# EAGLE design 70MHz_DDS_generator (EAGLE 7.3.0)
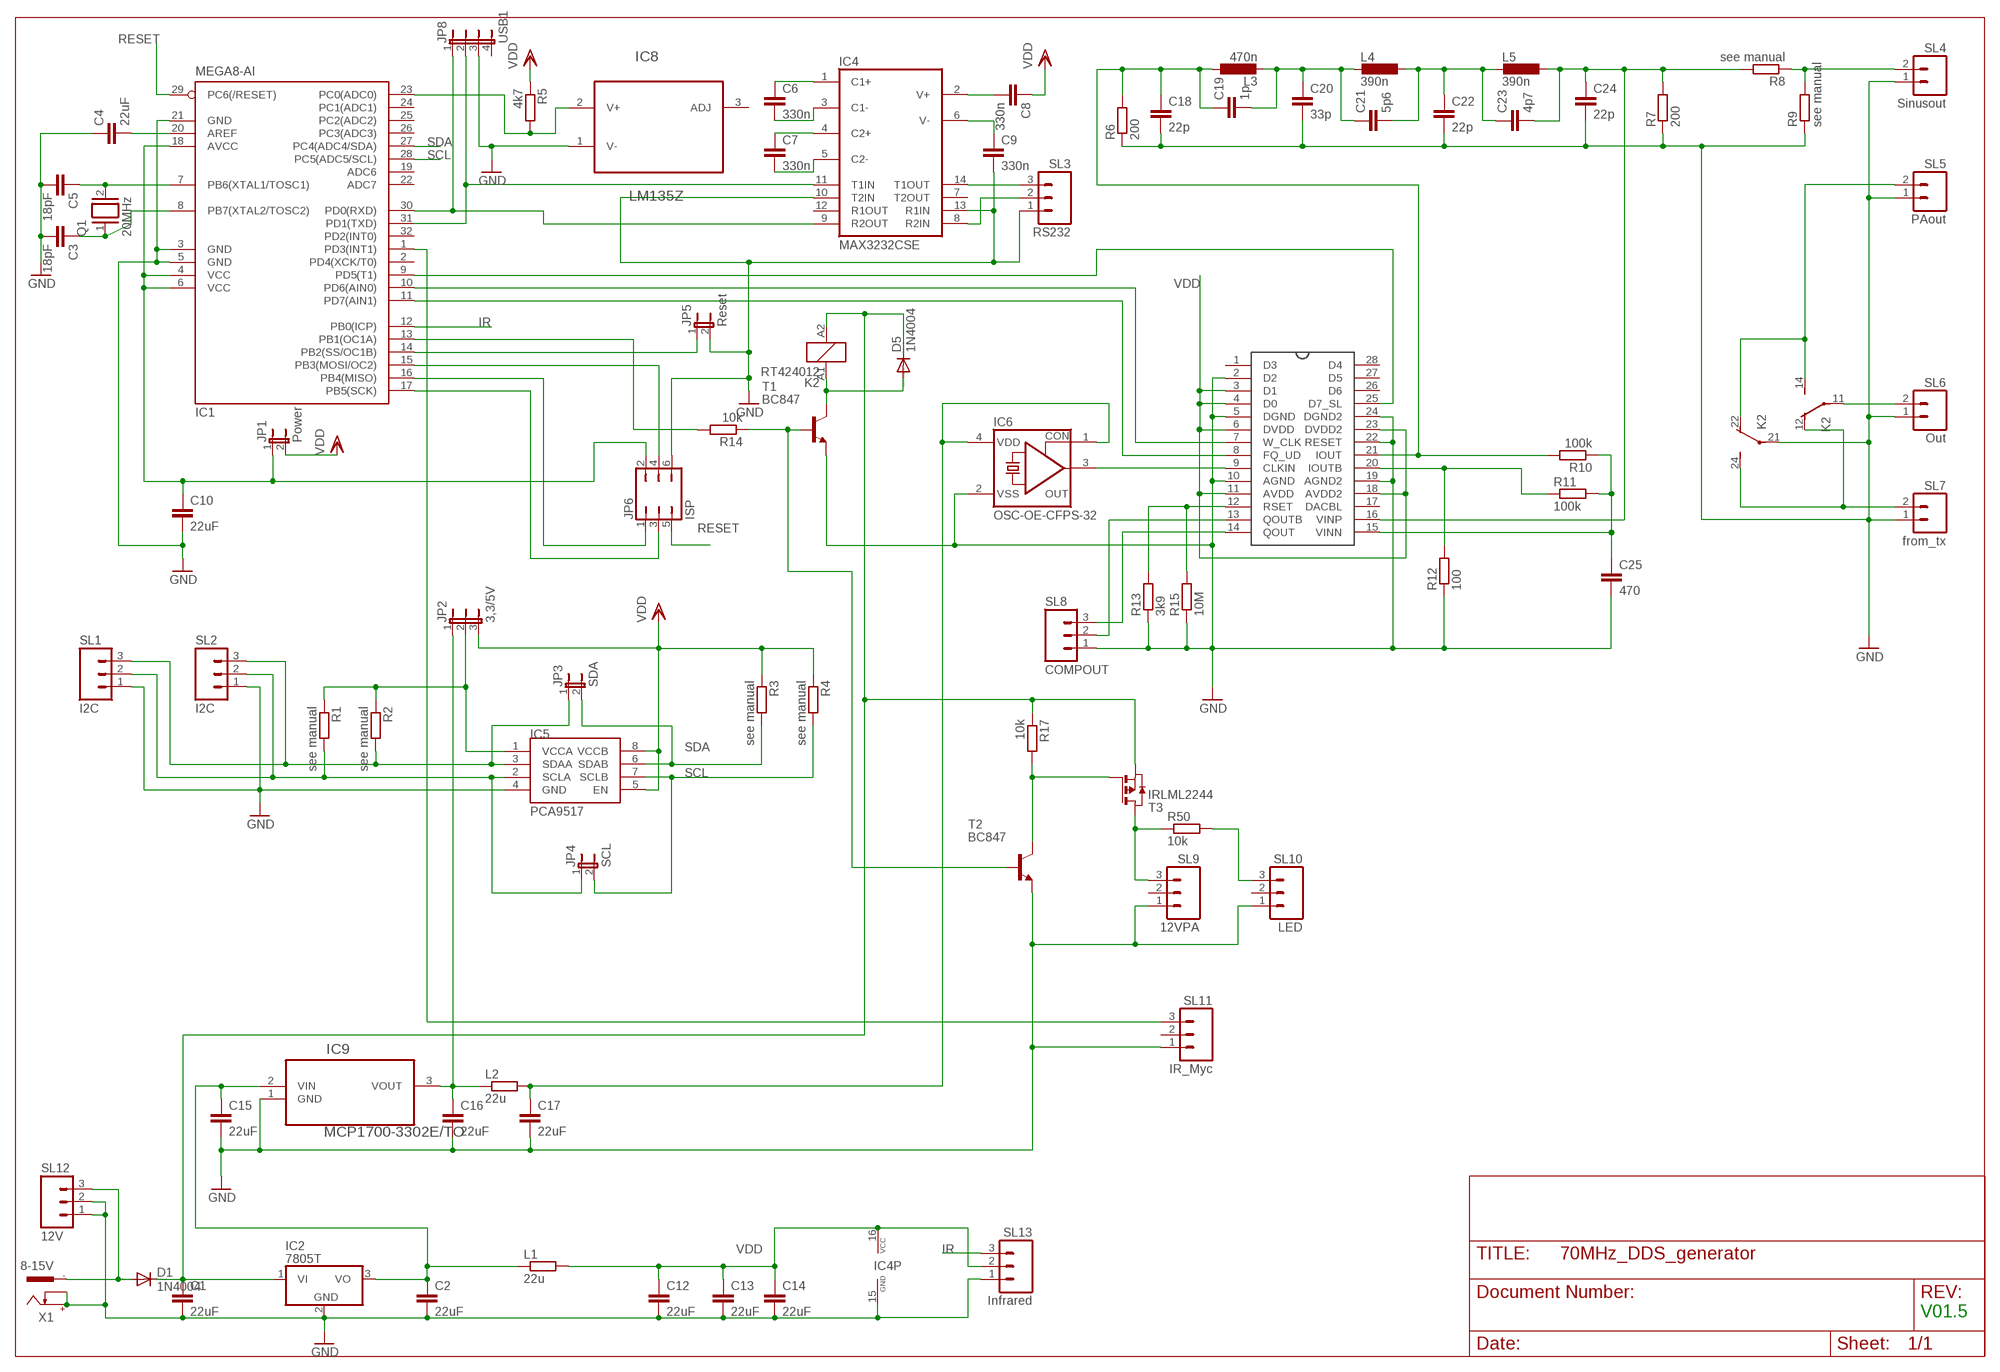
[diagram p0: schematic, sheet 1]

## Parts
C1  22uF  C-EUC1206  [C1206]
C2  22uF  C-EUC1206  [C1206]
C3  18pF  C-EU025-025X050  [C025-025X050]
C4  22uF  C-EUC1206  [C1206]
C5  18pF  C-EU025-025X050  [C025-025X050]
C6  330n  C-EUC1206  [C1206]
C7  330n  C-EUC1206  [C1206]
C8  330n  C-EUC1206  [C1206]
C9  330n  C-EUC1206  [C1206]
C10  22uF  C-EUC1206  [C1206]
C12  22uF  C-EUC1206  [C1206]
C13  22uF  C-EUC1206  [C1206]
C14  22uF  C-EUC1206  [C1206]
C15  22uF  C-EUC1206  [C1206]
C16  22uF  C-EUC1206  [C1206]
C17  22uF  C-EUC1206  [C1206]
C18  22p  C-EUC0805K  [C0805K]
C19  1p  C-EUC0805K  [C0805K]
C20  33p  C-EUC0805K  [C0805K]
C21  5p6  C-EUC0805K  [C0805K]
C22  22p  C-EUC0805K  [C0805K]
C23  4p7  C-EUC0805K  [C0805K]
C24  22p  C-EUC0805K  [C0805K]
C25  470  C-EUC1206  [C1206]
D1  1N4004  [DO41-10]
D5  1N4004  [DO41-10]
IC1  MEGA8-AI  [TQFP32-08]
IC2  7805T  [TO220H]
IC4  MAX3232CSE  [SO16]
IC5  PCA9517  [SO-08]
IC6  OSC-OE-CFPS-32  [7.2X5.2-4-PAD]
IC7  AD9851  AD9850  [SSOP28]
IC8  LM135Z  [TO127P254X533-3P]
IC9  MCP1700-3302E/TO  MCP1700-2702E/TO  [TO127P254X495-3]
JP1  Power  JP1E  [JP1]
JP2  3,3/5V  JP2E  [JP2]
JP3  SDA  JP1E  [JP1]
JP4  SCL  JP1E  [JP1]
JP5  Reset  JP1E  [JP1]
JP6  ISP  JP3Q  [JP3Q]
JP8  USB1  JP4E  [JP4]
K2  RT424012  [RT2C/O]
L1  22u  R-EU_R6332  [R6332]
L2  22u  R-EU_R6332  [R6332]
L3  470n  L-EUL4532C  [L4532M]
L4  390n  L-EUL4532C  [L4532M]
L5  390n  L-EUL4532C  [L4532M]
Q1  20MHz  XTAL/S  [QS]
R1  see manual  R-EU_R1206  [R1206]
R2  see manual  R-EU_R1206  [R1206]
R3  see manual  R-EU_R1206  [R1206]
R4  see manual  R-EU_R1206  [R1206]
R5  4k7  R-EU_R1206  [R1206]
R6  200  R-EU_R1206  [R1206]
R7  200  R-EU_R1206  [R1206]
R8  see manual  R-EU_R1206  [R1206]
R9  see manual  R-EU_R1206  [R1206]
R10  100k  R-EU_R1206  [R1206]
R11  100k  R-EU_R1206  [R1206]
R12  100  R-EU_R1206  [R1206]
R13  3k9  R-EU_R1206  [R1206]
R14  10k  R-EU_R1206  [R1206]
R15  10M  R-EU_R1206  [R1206]
R17  10k  R-EU_R1206  [R1206]
R50  10k  R-EU_R1206  [R1206]
SL1  I2C  M03  [03P]
SL2  I2C  M03  [03P]
SL3  RS232  M03  [03P]
SL4  Sinusout  M02  [02P]
SL5  PAout  M02  [02P]
SL6  Out  M02  [02P]
SL7  from_tx  M02  [02P]
SL8  COMPOUT  M03  [03P]
SL9  12VPA  M03  [03P]
SL10  LED  M03  [03P]
SL11  IR_Myc  M03  [03P]
SL12  12V  M03  [03P]
SL13  Infrared  M03  [03P]
T1  BC847  [SOT23]
T2  BC847  [SOT23]
T3  IRLML2244  PMOSSOT23  [SOT-23]
X1  8-15V  737992-55  [737992-5]

## Nets
GND: C1.2 C2.2 C3.2 C4.1 C5.2 C9.2 C10.2 C12.2 C13.2 C14.2 C15.2 C16.2 C17.2 C18.2 C20.2 C22.2 C24.2 C25.2 IC1.3(GND) IC1.5(GND) IC1.21(GND) IC2.2(GND) IC4.10(T2IN) IC4.13(R1IN) IC4.15(GND) IC5.4(GND) IC6.2(VSS) IC7.2(D2) IC7.5(DGND) IC7.10(AGND) IC7.19(AGND2) IC7.22(RESET) IC7.24(DGND2) IC8.1(V-) IC9.1(GND) JP5.2 JP6.6 JP8.3 K2.21(3:P) R6.1 R7.1 R9.1 R12.1 R13.1 R15.1 SL1.1 SL2.1 SL3.1 SL4.1 SL5.1 SL6.1 SL7.1 SL8.1 SL9.1 SL10.1 SL11.1 SL12.1 SL12.2 SL13.1 T1.2(E) T2.2(E) X1.+ X1.K
IR: IC1.12(PB0(ICP)) SL13.3
N$1: IC1.9(PD5(T1)) IC7.25(D7_SL)
N$2: C5.1 IC1.7(PB6(XTAL1/TOSC1)) Q1.2
N$3: C3.1 IC1.8(PB7(XTAL2/TOSC2)) Q1.1
N$4: C4.2 IC1.20(AREF)
N$5: IC5.3(SDAA) JP3.1 R2.2 SL1.3 SL2.3
N$6: IC1.16(PB4(MISO)) JP6.1
N$7: D1.A SL12.3 X1.-1
N$8: C10.1 IC1.4(VCC) IC1.6(VCC) IC1.18(AVCC) JP1.1 JP6.2
N$9: IC1.17(PB5(SCK)) JP6.3
N$10: IC1.14(PB2(SS/OC1B)) JP5.1
N$11: IC1.15(PB3(MOSI/OC2)) JP6.4
N$12: C7.2 IC4.5(C2-)
N$13: IC5.1(VCCA) JP2.2 R1.1 R2.1
N$14: IC5.2(SCLA) JP4.1 R1.2 SL1.2 SL2.2
N$15: IC4.14(T1OUT) SL3.3
N$16: C8.2 IC4.2(V+)
N$17: K2.12(2:O) K2.24(3:S) SL7.2
N$18: C2.1 C15.1 IC2.3(VO) IC9.2(VIN) L1.1
N$19: IC1.10(PD6(AIN0)) IC7.7(W_CLK)
N$20: IC4.8(R2IN) SL3.2
N$21: R50.2 SL10.3
N$22: C7.1 IC4.4(C2+)
N$23: K2.14(2:S) K2.22(3:O) SL5.2
N$24: C21.2 C22.1 C23.1 L4.1 L5.2
N$25: C17.1 IC6.1(CON) IC6.4(VDD) L2.2
N$27: C18.1 C19.1 IC7.21(IOUT) L3.1 R6.2 R10.2
N$28: C19.2 C20.1 C21.1 L3.2 L4.2
N$29: C9.1 IC4.6(V-)
N$30: IC1.11(PD7(AIN1)) IC7.8(FQ_UD)
N$31: IC6.3(OUT) IC7.9(CLKIN)
N$32: R14.1 T1.1(B) T2.1(B)
N$33: C23.2 C24.1 IC7.16(VINP) L5.1 R7.2 R8.2
N$34: IC1.30(PD0(RXD)) IC4.9(R2OUT) JP8.1
N$35: D5.A K2.A1 T1.3(C)
N$36: IC7.12(RSET) R13.2 R15.2
N$37: C25.1 IC7.15(VINN) R10.1 R11.2
N$38: IC7.14(QOUT) SL8.3
N$39: IC1.23(PC0(ADC0)) IC8.2(V+) R5.2
N$40: IC7.20(IOUTB) R11.1 R12.2
N$41: K2.11(2:P) SL6.2
N$42: R50.1 SL9.3 T3.1(D)
N$43: R17.2 T2.3(C) T3.3(G)
N$44: IC1.31(PD1(TXD)) IC4.11(T1IN) JP8.2
N$45: IC1.13(PB1(OC1A)) R14.2
N$46: C1.1 D1.C D5.C IC2.1(VI) K2.A2 R17.1 T3.2(S)
N$47: IC1.1(PD3(INT1)) SL11.3
N$48: C6.1 IC4.1(C1+)
N$50: IC7.13(QOUTB) SL8.2
N$51: R8.1 R9.2 SL4.2
N$52: C6.2 IC4.3(C1-)
N$76: C16.1 IC9.3(VOUT) JP2.1 L2.1
RESET: IC1.29(PC6(/RESET)) JP6.5
SCL: IC1.28(PC5(ADC5/SCL)) IC5.7(SCLB) JP4.2 R4.2
SDA: IC1.27(PC4(ADC4/SDA)) IC5.6(SDAB) JP3.2 R3.2
VDD: C8.1 C12.1 C13.1 C14.1 IC4.16(VCC) IC5.5(EN) IC5.8(VCCB) IC7.3(D1) IC7.4(D0) IC7.6(DVDD) IC7.11(AVDD) IC7.18(AVDD2) IC7.23(DVDD2) JP1.2 JP2.3 L1.2 R3.1 R4.1 R5.1 SL13.2
Unconnected: IC1.2(PD4(XCK/T0)) IC1.19(ADC6) IC1.22(ADC7) IC1.24(PC1(ADC1)) IC1.25(PC2(ADC2)) IC1.26(PC3(ADC3)) IC1.32(PD2(INT0)) IC4.7(T2OUT) IC4.12(R1OUT) IC7.1(D3) IC7.17(DACBL) IC7.26(D6) IC7.27(D5) IC7.28(D4) IC8.3(ADJ) JP8.4 SL9.2 SL10.2 SL11.2 X1.-2

## Notes on the sheet
- V01.5

## Library data of the parts
C1 C2 C4 C6-C10 C12-C25 = rcl:C-EU: CAPACITOR, European symbol
C3 C5 = resistor:C-EU: CAPACITOR, European symbol
D1 D5 = diode:1N4004: DIODE general purpose rectifier, 1 A
IC1 = atmel:MEGA8: MICROCONTROLLER 8 Kbytes FLASH, 1 kbytes SRAM, 512 bytes EEPROM, USART, 6-channel 10 bit ADC, 2-channel 8 bit ADC Pin compatible with Atmega48, ATMega88, ATMega168 Source: avr.lbr; MPN: ATMEGA8-16AU; OC_FARNELL: 9171371; OC_NEWARK: 73M8863
IC2 = linear:78*: Positive VOLTAGE REGULATOR Source: http://cache.national.com/ds/LM/LM78L05.pdf http://www.fairchildsemi.com/ds/LM/LM7805.pdf
IC4 = maxim:MAX3232*: True RS-232 Transceivers 3.0V to 5.5V, Low-Power up to 1Mbps, Using Four 0.1µF External Capacitors Source: http://pdfserv.maxim-ic.com/en/ds/MAX3222-MAX3241.pdf; MPN: MAX3232CSE; OC_FARNELL: 9725490; OC_NEWARK: 90C2890
IC5 = PCA9517:PCA9517: PCA9517
IC6 = IQD-Frequency-Products:OSC-OE: OSCILLATOR WITH OE
IC7 = AD9850:AD9850: CMOS, 125 MHz Complete DDS Synthesizer Check prices <https://pricing.snapeda.com/parts/AD9850/Analog%20Devices/view-part?ref=eda>; AVAILABILITY: Bad; DESCRIPTION: Direct Digital Synthesis IC 10 b 125MHz 32 b Tuning 28-SSOP; MF: Analog Devices; MP: AD9850; PACKAGE: SSOP-28 Analog Devices; PRICE: None
IC8 = LM135Z:LM135Z: Precision temperature sensors Check prices <https://pricing.snapeda.com/parts/LM135Z/STMicroelectronics/view-part?ref=eda>; AVAILABILITY: In Stock; DESCRIPTION: Temperature Sensor Analog, Local -55°C ~ 150°C 10mV/°C TO-92-3; MF: STMicroelectronics; MP: LM135Z; PACKAGE: TO-92 STMicroelectronics; PRICE: None
IC9 = MCP1700-2702E_TO:MCP1700-2702E/TO: IC LDO REG 250MA 5.0V Check prices <https://pricing.snapeda.com/parts/MCP1700-2702E/TO/Microchip/view-part?ref=eda>; AVAILABILITY: In Stock; DESCRIPTION: Linear Voltage Regulator IC Positive Fixed 1 Output 250mA TO-92-3; MF: Microchip; MP: MCP1700-2702E/TO; PACKAGE: TO-92 Microchip; PRICE: None
JP1 JP3-JP5 = jumper:JP1E: JUMPER
JP2 = jumper:JP2E: JUMPER
JP6 = jumper:JP3Q: JUMPER
JP8 = jumper:JP4E: JUMPER
K2 = relay:RT42?*: Power PCB Relay SCHRACK 2 pole 8 A, DC and AC-coil Source: http://www.schrack.com/.. 5842.pdf; MPN: RT424012; OC_FARNELL: 1629053; OC_NEWARK: 03P2426
L1 L2 R1-R4 R17 R50 = resistor:R-EU_: RESISTOR, European symbol
L3-L5 = rcl:L-EU: INDUCTOR, European symbol
Q1 = special:XTAL/S: CRYSTAL
R5-R15 = rcl:R-EU_: RESISTOR, European symbol
SL1-SL3 SL8-SL13 = con-amp-quick:M03: AMP QUICK CONNECTOR; OC_FARNELL: unknown; OC_NEWARK: unknown
SL4-SL7 = con-amp-quick:M02: AMP QUICK CONNECTOR; OC_FARNELL: unknown; OC_NEWARK: unknown
T1 T2 = transistor:BC847: NPN TRANSISTOR
T3 = zetex:PMOSSOT23: MOS FET; OC_FARNELL: unknown; OC_NEWARK: unknown
X1 = con-conrad:737992-55: FEMALE PRINT CONNECTOR DIN 45323 (34V/3A), ROKA, distributor Conrad

## Board
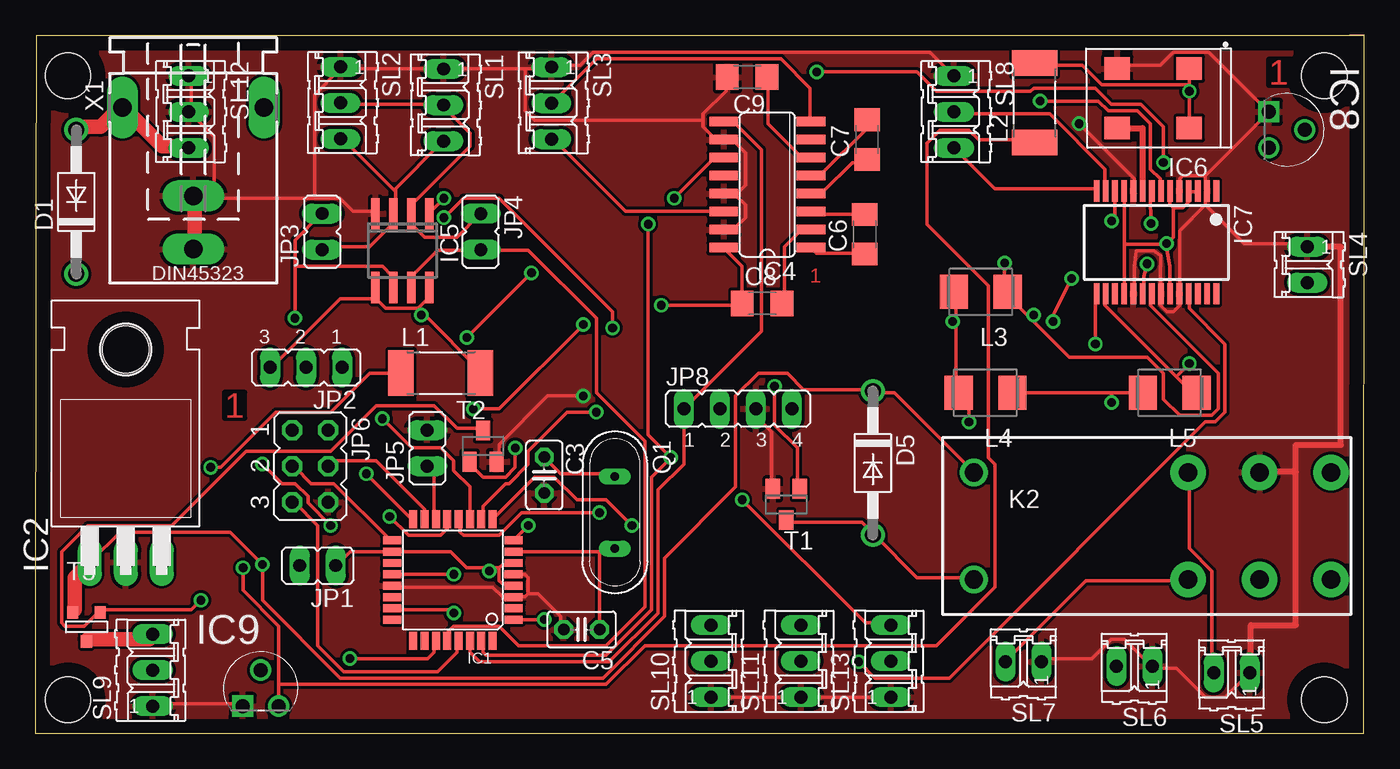
[diagram p1: board, top side]
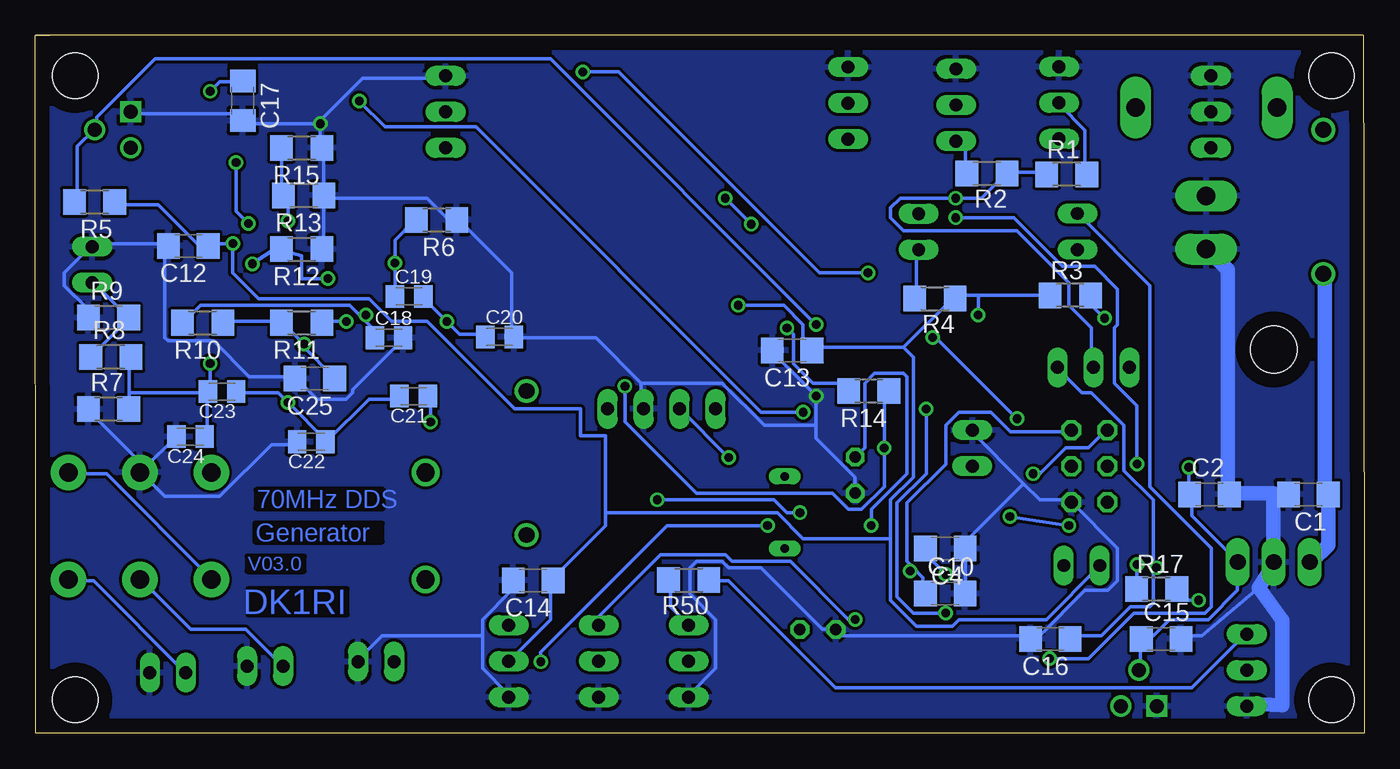
[diagram p2: board, bottom side, seen from below]

Size 93.73 x 49.21 mm. Coordinates in mm from the lower left corner, seen from the top.
Outline: 93.73,49.21 93.71,0 0,0.01 0.02,36.84 0.04,49.21 93.73,49.21
Outline: 93.73,49.21 92.73,49.21
Copper layers (1*2*16): Top 0.035mm / dielectric 1.5mm / signal2 0.035mm / dielectric 0.15mm / Bottom 0.035mm
Design rules "default *": minimum track width 10mil, minimum drill 24mil, track to track 8mil, track to pad 8mil, pad to pad 8mil, via to via 8mil, smd to smd 8mil, copper to edge 40mil, drill to drill 8mil, minimum pad ring 10mil, minimum via ring 8mil, stop-mask expansion 4mil, vias tented up to drill 0mil, thermal gap 10mil
Holes 3.2 mm at 2.29,46.37 2.29,2.37 90.92,2.37 90.92,46.37

### Footprints (pad centres in the part's own frame; a part is rotated, then mirrored left to right if it is on the bottom)
C1206 = smd 1.6 x 1.8: 1 -1.4,0; 2 1.4,0
C025-025X050 = drill 0.813 octagon: 1 -1.27,0; 2 1.27,0
C0805K = smd 1.3 x 1.6: 1 -1,0; 2 1,0
DO41-10 = drill 1.118: A 5.08,0; C -5.08,0
TQFP32-08 = smd 1.27 x 0.559: 1 -4.293,2.8; 2 -4.293,2; 3 -4.293,1.2; 4 -4.293,0.4; 5 -4.293,-0.4; 6 -4.293,-1.2; 7 -4.293,-2; 8 -4.293,-2.8; 17 4.293,-2.8; 18 4.293,-2; 19 4.293,-1.2; 20 4.293,-0.4; 21 4.293,0.4; 22 4.293,1.2; 23 4.293,2; 24 4.293,2.8 | smd 0.559 x 1.27: 9 -2.8,-4.293; 10 -2,-4.293; 11 -1.2,-4.293; 12 -0.4,-4.293; 13 0.4,-4.293; 14 1.2,-4.293; 15 2,-4.293; 16 2.8,-4.293; 25 2.8,4.293; 26 2,4.293; 27 1.2,4.293; 28 0.4,4.293; 29 -0.4,4.293; 30 -1.2,4.293; 31 -2,4.293; 32 -2.8,4.293
TO220H = drill 1.118 long: 1 -2.54,-10.16; 2 0,-10.16; 3 2.54,-10.16 | hole 3.302: 0,4.826
SO16 = smd 0.66 x 2.032: 1 -4.445,-3.073; 2 -3.175,-3.073; 3 -1.905,-3.073; 4 -0.635,-3.073; 5 0.635,-3.073; 6 1.905,-3.073; 7 3.175,-3.073; 8 4.445,-3.073; 9 4.445,3.073; 10 3.175,3.073; 11 1.905,3.073; 12 0.635,3.073; 13 -0.635,3.073; 14 -1.905,3.073; 15 -3.175,3.073; 16 -4.445,3.073
SO-08 = smd 0.6 x 2.2: 1 -1.905,-2.6; 2 -0.635,-2.6; 3 0.635,-2.6; 4 1.905,-2.6; 5 1.905,2.6; 6 0.635,2.6; 7 -0.635,2.6; 8 -1.905,2.6
7.2X5.2-4-PAD = smd 1.8 x 1.6: 1 -2.54,-2.1; 2 2.54,-2.1; 3 2.54,2.1; 4 -2.54,2.1
SSOP28 = smd 0.4 x 1.5: 1 -4.225,-3.625; 2 -3.575,-3.625; 3 -2.925,-3.625; 4 -2.275,-3.625; 5 -1.625,-3.625; 6 -0.975,-3.625; 7 -0.325,-3.625; 8 0.325,-3.625; 9 0.975,-3.625; 10 1.625,-3.625; 11 2.275,-3.625; 12 2.925,-3.625; 13 3.575,-3.625; 14 4.225,-3.625; 15 4.225,3.625; 16 3.575,3.625; 17 2.925,3.625; 18 2.275,3.625; 19 1.625,3.625; 20 0.975,3.625; 21 0.325,3.625; 22 -0.325,3.625; 23 -0.975,3.625; 24 -1.625,3.625; 25 -2.275,3.625; 26 -2.925,3.625; 27 -3.575,3.625; 28 -4.225,3.625
TO127P254X533-3P = drill 0.991 square: 1 -2.54,-2.54 | drill 0.991: 2 -1.27,0; 3 0,-2.54
TO127P254X495-3 = drill 0.991 square: 1 -2.54,-2.54 | drill 0.991: 2 -1.27,0; 3 0,-2.54
JP1 = drill 0.914 long: 1 0,-1.27; 2 0,1.27
JP2 = drill 0.914 long: 1 -2.54,0; 2 0,0; 3 2.54,0
JP3Q = drill 0.914 octagon: 1 -2.54,-1.27; 2 -2.54,1.27; 3 0,-1.27; 4 0,1.27; 5 2.54,-1.27; 6 2.54,1.27
JP4 = drill 0.914 long: 1 -3.81,0; 2 -1.27,0; 3 1.27,0; 4 3.81,0
RT2C/O = drill 1.3 pad 2.5: 11 7.56,-3.68; 12 2.52,-3.68; 14 12.6,-3.68; 21 7.56,3.88; 22 2.52,3.88; 24 12.6,3.88 | drill 1.3: A1 -12.6,-3.68; A2 -12.6,3.88
R6332 = smd 1.8 x 3.2: 1 -2.8,0; 2 2.8,0
L4532M = smd 2 x 2.4: 1 -1.9,0; 2 1.9,0
QS = drill 0.61 long: 1 -2.54,0; 2 2.54,0
R1206 = smd 1.6 x 1.803: 1 -1.422,0; 2 1.422,0
03P = drill 0.914 long: 1 -2.54,0; 2 0,0; 3 2.54,0
02P = drill 0.914 long: 1 -1.27,0; 2 1.27,0
SOT23 = smd 1 x 1.4: 1 -0.95,-1.1; 2 0.95,-1.1; 3 0,1.1
SOT-23 = smd 0.787 x 0.889: 1 0.025,-1.016; 2 -0.94,1.016; 3 0.991,1.016
737992-5 = drill 1.3 pad 2.184 long: + 0,10; -1 5,0; -2 -5,0; K 0,6.25

### Placement (x,y rotation side)
C1  3.92,16.84 180 bottom
C2  10.91,16.84 0 bottom
C3  35.9,18.2 270 top
C4  29.55,13.03 180 bottom
C5  38.53,7.32 180 top
C6  58.51,35.2 90 top
C7  58.66,41.86 90 top
C8  51.27,30.32 0 top
C9  50.21,46.27 180 top
C10  29.55,9.85 0 bottom
C12  82.95,34.37 180 bottom
C13  40.34,27 180 bottom
C14  58.62,10.78 180 bottom
C15  14.31,6.65 0 bottom
C16  22.13,6.66 180 bottom
C17  79.1,44.61 270 bottom
C18  68.79,27.89 0 bottom
C19  67.38,30.81 0 bottom
C20  60.98,27.95 0 bottom
C21  67.06,23.78 180 bottom
C22  74.27,20.55 180 bottom
C23  80.57,24.09 180 bottom
C24  82.79,20.92 180 bottom
C25  74.02,25.01 180 bottom
D1  2.88,37.48 90 top
D5  59.08,19.06 270 top
IC1  29.45,10.81 180 top
IC2  6.37,22.24 0 top
IC4  51.63,38.7 90 top
IC5  25.89,34.04 180 top
IC6  78.85,44.78 180 top
IC7  79.08,34.62 180 top
IC8  89.55,41.29 270 top
IC9  17.16,4.46 0 top
JP1  19.92,11.83 90 top
JP2  19.08,25.81 180 top
JP3  20.21,35.39 0 top
JP4  31.42,35.38 180 top
JP5  27.64,20.11 0 top
JP6  19.39,18.84 270 top
JP8  49.55,22.87 0 top
K2  78.81,14.52 0 top
L1  28.59,25.41 0 top
L2  70.49,44.46 90 top
L3  66.69,31.13 180 top
L4  67.02,24.01 180 top
L5  80.02,24.01 180 top
Q1  40.88,15.57 270 top
R1  20.97,39.41 0 bottom
R2  26.59,39.48 180 bottom
R3  20.72,30.88 0 bottom
R4  30.28,30.65 180 bottom
R5  89.55,37.48 180 bottom
R6  65.42,36.21 180 bottom
R7  88.58,22.86 0 bottom
R8  88.41,26.54 0 bottom
R9  88.58,29.31 0 bottom
R10  81.94,28.95 180 bottom
R11  74.95,28.95 180 bottom
R12  74.95,34.14 180 bottom
R13  74.8,37.93 180 bottom
R14  34.95,24.14 180 bottom
R15  74.95,41.29 180 bottom
R17  14.62,10.17 0 bottom
R50  47.65,10.81 180 bottom
SL1  28.78,44.31 270 top
SL2  21.52,44.46 270 top
SL3  36.4,44.45 270 top
SL4  89.72,33.05 270 top
SL5  84.38,4.28 180 top
SL6  77.53,4.74 180 top
SL7  69.7,5.05 180 top
SL8  64.79,43.83 270 top
SL9  8.28,4.46 90 top
SL10  47.65,5.09 90 top
SL11  54,5.09 90 top
SL12  10.81,43.83 270 top
SL13  60.35,5.09 90 top
T1  52.97,16.14 180 top
T2  31.57,20.26 0 top
T3  3.58,7.5 0 top
X1  11.13,44.15 180 top

### Tracks (layer width: path | path; a pad name or v marks a point on that pad's centre or on a via)
GND  (via drill 0.61)
  Top 0.254: 49.4,37.96 50.08,37.27 50.08,36.36 49.4,35.67 48.71,35.67 IC4.15 | 49.4,37.96 48.71,37.96 IC4.13 49.4,37.96 | 47.11,43.22 47.11,42.76 47.8,42.07 48.48,42.07 IC4.10 48.71,41.85 49.17,41.85 50.08,40.93 50.08,38.65 49.4,37.96 | 47.11,43.22 47.11,43.68 48.71,45.28 48.71,46.19 C9.2 | 34.54,46.88 28.82,46.88 SL1.1 28.59,46.88 21.74,46.88 SL2.1 21.51,46.88 19.68,45.05 19.68,37.73 | 34.54,46.88 36.37,46.88 SL3.1 36.6,47.1 38.43,47.1 39.34,48.02 63.11,48.02 64.71,46.42 SL8.1 | 47.11,43.22 35.22,43.22 34.54,43.9 34.54,46.88 | SL9.1 8.48,2.07 14.42,2.07 IC9.1 | SL12.1 10.99,46.19 10.99,43.9 SL12.2 10.99,43.68 12.59,42.07 12.59,37.73 | 12.59,37.73 11.22,37.73 X1.K 12.59,37.73 | 12.59,37.73 19.68,37.73 | 19.68,37.73 21.51,37.73 22.42,36.82 23.79,36.82 IC5.4 | 11.22,34.3 X1.+ | v38.65,23.79 36.14,23.79 32.71,20.36 32.71,19.21 T2.2 | T1.2 51.91,17.39 51.91,21.27 51,22.19 51,22.87 JP8.3 | IC7.19 77.52,31.1 77.52,32.93 77.66,34.02 78.89,34.02 79.39,33.67 79.39,32.93 79.34,32.93 79.34,31.1 IC7.22 79.34,30.87 79.34,30.19 79.8,29.73 80.26,29.73 80.72,30.19 80.72,30.87 IC7.24 80.72,31.1 80.72,35.45 82.55,37.27 | 82.55,39.33 80.94,39.33 80.72,39.1 80.72,38.42 IC7.5 | 82.55,39.33 82.55,38.42 IC7.2 82.55,38.19 82.55,37.27 | IC6.2 76.37,47.1 79.34,47.1 80.26,48.02 82.77,48.02 86.89,43.9 IC8.1 86.89,43.68 82.55,39.33 | v73.63,42.99 77.52,39.1 77.52,38.42 IC7.10 | 34.77,9.84 34.54,9.61 33.85,9.61 IC1.3 33.62,9.61 32.94,9.61 32.25,10.3 25.17,10.3 IC1.21 | 34.77,9.84 34.77,10.99 34.54,11.21 33.85,11.21 IC1.5 | 34.77,9.84 35.45,9.84 37.05,8.24 37.05,7.33 C5.2 | SL10.1 47.8,2.53 53.97,2.53 SL11.1 54.2,2.53 60.14,2.53 SL13.1
  Top 0.254: SL7.1 71.11,5.27 74.54,5.27 75.91,6.64 76.83,6.64 78.66,4.81 SL6.1 78.89,4.58 80.49,4.58 82.55,2.53 83.92,2.53 85.52,4.13 SL5.1 | 82.55,37.27 85.29,34.53 89.63,34.53 SL4.1
  Top 0.406: SL5.1 85.74,4.28 85.74,7.63 88.92,7.63 88.92,18.43 | 88.92,18.43 86.37,18.43 K2.21 | 88.92,18.43 88.92,20.33 92.09,20.33 92.09,34.3 89.72,34.3 SL4.1
  Top 1.016: 11.22,37.73 11.22,34.3
  Bottom 0.254: 6.42,16.93 5.51,16.93 C1.2 | 9.39,16.93 C2.2 9.62,16.93 | 7.44,10.25 11.45,6.87 12.82,6.87 C15.2 | 6.42,11.9 IC2.2 6.42,12.13 | 8.25,2.07 SL9.1 | 10.99,34.07 X1.+ | C13.2 41.85,26.99 v38.65,23.79 38.65,21.73 | 38.65,21.73 38.65,20.82 35.91,18.07 35.91,17.16 C3.2 | 51,24.7 51,22.87 JP8.3 | 51,24.7 54.2,27.9 59.91,27.9 C20.2 60.14,28.13 60.14,32.47 63.8,36.13 R6.1 64.03,36.36 64.71,36.36 66.08,37.73 73.17,37.73 R13.1 | 38.65,21.73 42.31,21.73 45.28,24.7 51,24.7 | 73.86,42.99 78.89,42.99 C17.2 79.12,43.22 79.57,43.68 86.89,43.68 IC8.1 | R13.1 73.4,37.96 73.4,41.16 R15.1 73.63,41.39 v73.63,42.99 73.86,42.99 | R12.1 73.4,34.3 73.4,37.73 R13.1 | 73.86,42.99 70.66,46.19 64.94,46.19 SL8.1 | C10.2 28.14,10.07 28.14,12.81 C4.1 28.14,13.04 28.14,13.5 24.02,17.61 | 24.02,17.61 27.68,21.27 JP5.2 | 24.02,17.61 22.88,16.47 20.82,16.47 JP6.6 20.59,16.24 17.39,13.04 17.39,10.76 18.08,10.07 19.68,10.07 22.88,6.87 23.34,6.87 C16.2 23.57,6.87 36.83,6.87 37.05,7.1 C5.2 37.28,7.33 38.2,7.33 42.54,11.67 44.83,11.67 45.28,12.13 47.11,12.13 47.57,11.67 47.57,9.84 45.74,8.01 45.74,4.58 47.57,2.76 SL10.1 | 62.2,6.87 62.2,4.58 60.37,2.76 SL13.1 | 62.2,6.87 62.2,8.01 60.14,10.07 60.14,10.76 C14.2 | C18.2 67.91,27.67 71.34,24.24 71.34,24.02 71.8,23.56 73.86,23.56 75.23,24.93 C25.2 75.46,25.16 78.66,25.16 81.17,27.67 84.37,27.67 84.6,27.9 84.6,34.53 | C22.2 75.46,20.36 77.06,20.36 80.72,16.7 84.6,16.7 86.2,18.3 K2.21 | 85.97,18.76 86.2,18.53 K2.21 | 85.97,18.76 83.92,20.82 C24.2 | 84.6,34.53 89.63,34.53 SL4.1 89.86,34.3 91.69,32.47 91.69,31.56 90.09,29.96 90.09,29.5 R9.1 | 84.6,34.53 84.37,34.53 C12.2 84.6,34.53
  Bottom 0.254: 85.97,18.76 89.86,22.64 R7.1 | 85.97,18.76 K2.21 | 62.2,6.87 69.29,6.87 70.89,5.27 SL7.1
  Bottom 1.016: 9.39,16.93 6.42,16.93 6.42,12.13 | 6.42,11.9 7.44,10.25 5.79,7.96 5.79,1.99 8.25,2.07 | 9.62,16.93 9.62,32.7 10.99,34.07
  pour Bottom: 0.66,48.27 93.36,48.27 93.36,0.65 0.66,0.65
  pour Top: 0.66,48.27 93.36,48.27 93.36,0.65 0.66,0.65
IR  (via drill 0.61)
  Top 0.254: v39.8,15.56 34.31,15.56 32.71,13.96 30.2,13.96 29.97,14.19 29.97,15.1 IC1.12 | v49.86,16.47 58.54,7.78 60.14,7.78 SL13.3
  Bottom 0.254: v39.8,15.56 40.71,15.56 41.62,16.47 v49.86,16.47
N$1  (via drill 0.61)
  Top 0.254: IC1.9 35.22,18.07 36.6,18.07 38.2,16.47 40.25,16.47 v42.08,14.64 | v58.08,5.04 59.23,3.9 64.48,3.9 82.55,21.96 83.23,21.96 83.92,22.64 83.92,27.44 81.4,29.96 81.4,30.87 IC7.25 | IC1.9
  Bottom 0.254: v42.08,14.64 49.17,14.64 58.08,5.73 v58.08,5.04
N$2
  Top 0.254: 39.8,12.81 40.71,12.81 Q1.2 39.8,12.81 | 39.8,12.81 33.85,12.81 IC1.7 | 39.8,12.81 39.8,7.33 C5.1
N$3  (via drill 0.61)
  Top 0.254: v34.77,14.64 33.85,13.73 IC1.8 | Q1.1 40.71,18.3 37.05,18.3 35.91,19.44 C3.1
  Bottom 0.254: v34.77,14.64 34.77,15.79 32.25,18.3 32.25,25.16 32.48,25.39 34.54,25.39 35.22,24.7 35.22,20.13 35.68,19.67 C3.1
N$4  (via drill 0.61)
  Top 0.254: v29.51,11.21 IC1.20
  Bottom 0.254: v29.51,11.21 31.11,12.81 C4.2
N$5
  Top 0.254: 25.39,38.19 25.39,38.42 28.59,41.62 SL1.3 | 25.39,38.19 25.39,36.82 IC5.3 25.17,36.59 25.17,35.9 23.57,34.3 20.36,34.3 JP3.1 | 25.39,38.19 21.74,41.85 SL2.3
  Bottom 0.254: R2.2 28.14,39.56 28.14,41.16 28.59,41.62 SL1.3
N$6  (via drill 0.61)
  Top 0.254: v23.34,18.3 26.54,15.1 IC1.16
  Bottom 0.254: v23.34,18.3 22.88,18.3 21.05,20.13 19.45,20.13 18.31,21.27 JP6.1
N$7
  Top 0.254: 10.76,41.39 SL12.3 | 6.19,44.13 X1.-1 5.96,44.13 | 2.99,42.76 D1.A
  Top 1.016: 10.76,41.39 8.93,41.39 6.19,44.13 | 2.99,42.76 4.59,42.76 5.96,44.13
N$8  (via drill 0.61)
  Top 0.254: 32.71,11.67 32.71,10.76 32.94,10.53 33.62,10.53 IC1.4 | 32.71,11.67 32.94,11.9 33.62,11.9 IC1.6 | JP1.1 21.28,11.9 22.19,12.81 24.94,12.81 IC1.18 25.17,12.81 29.28,12.81 30.42,11.67 32.02,11.67 | 32.02,11.67 32.71,11.67 | v32.02,11.44 32.02,11.67
  Bottom 0.254: 31.79,11.67 32.25,12.13 32.25,16.24 29.51,18.99 29.51,21.73 28.59,22.64 26.31,22.64 24.94,21.27 20.82,21.27 JP6.2 | 31.79,11.67 31.11,10.99 31.11,10.07 C10.1 | 31.79,11.67 v32.02,11.44
N$9
  Top 0.254: IC1.17 24.94,13.73 21.05,17.61 19.45,17.61 18.31,18.76 JP6.3
N$10
  Top 0.254: IC1.14 28.14,15.1 28.14,18.3 27.68,18.76 JP5.1
N$11
  Top 0.254: IC1.15 27.45,15.79 24.02,19.21 21.05,19.21 20.82,18.99 JP6.4
N$12
  Top 0.254: C7.2 58.54,43.22 58.54,42.53 55.57,39.56 54.88,39.56 IC4.5
N$13  (via drill 0.61)
  Top 0.254: v28.82,37.73 27.91,36.82 IC5.1
  Bottom 0.254: R1.1 22.42,39.56 25.17,39.56 R2.1 25.39,39.33 27,37.73 v28.82,37.73 32.71,37.73 33.4,37.05 33.4,36.36 32.48,35.45 24.48,35.45 20.82,31.79 20.82,30.19 19.22,28.59 19.22,25.84 JP2.2
N$14
  Top 0.254: JP4.1 31.34,36.59 29.74,34.99 27.45,34.99 26.54,35.9 26.54,36.59 IC5.2 26.54,36.82 26.54,37.27 30.65,41.39 30.65,42.3 28.82,44.13 SL1.2 28.59,44.36 21.74,44.36 SL2.2
  Bottom 0.254: R1.2 19.68,39.56 19.68,42.53 21.51,44.36 SL2.2
N$15
  Top 0.254: IC4.14 48.48,36.82 41.62,36.82 36.6,41.85 SL3.3
N$16
  Top 0.254: C8.2 52.83,30.42 52.83,34.3 53.97,35.45 54.66,35.45 IC4.2
N$17
  Top 0.254: SL7.2 68.6,5.27 74.09,10.76 81.17,10.76 K2.12
  Bottom 0.254: K2.24 91.23,18.3 88.72,18.3 81.4,10.99 K2.12
N$18  (via drill 0.61)
  Top 0.254: v12.36,18.76 13.05,18.76 16.94,22.64 20.82,22.64 23.57,25.39 25.62,25.39 L1.1
  Bottom 0.254: IC9.2 15.79,4.58 15.79,6.64 C15.1 15.56,6.87 14.88,6.87 13.74,8.01 10.99,8.01 8.93,10.07 8.93,11.9 IC2.3 8.93,12.13 12.14,15.33 12.14,16.7 C2.1 12.36,16.93 v12.36,18.76
N$19  (via drill 0.61)
  Top 0.254: v39.57,22.64 37.51,22.64 34.77,19.9 34.77,18.99 33.4,17.61 33.17,17.61 31.57,16.01 31.57,15.1 IC1.10 | v70.89,44.59 75,44.59 75.69,43.9 77.74,43.9 78.66,42.99 78.66,39.79 79.34,39.1 79.34,38.42 IC7.7
  Bottom 0.254: v39.57,22.64 42.54,22.64 62.66,42.76 69.06,42.76 v70.89,44.59
N$20
  Top 0.254: IC4.8 54.66,43.22 54.66,45.5 52.6,47.56 39.57,47.56 36.6,44.59 SL3.2
N$21
  Bottom 0.254: SL10.3 48.94,8.93 48.94,10.76 R50.2
N$22
  Top 0.254: C7.1 58.54,40.25 57.63,40.25 55.57,38.19 54.88,38.19 IC4.4
N$23
  Top 0.254: K2.22 81.4,18.3 81.4,13.04 83,11.44 83,4.36 SL5.2
  Bottom 0.254: SL5.2 83.23,4.36 89.63,10.76 91.23,10.76 K2.14
N$24  (via drill 0.61)
  Top 0.254: 75.91,24.02 77.97,24.02 L5.2 | 75.91,24.02 69.06,24.02 L4.1 | v75.91,23.33 75.91,24.02
  Bottom 0.254: 73.17,20.59 70.2,23.56 68.14,23.56 C21.2 | 73.17,20.59 v75.91,23.33 76.6,24.02 79.34,24.02 C23.1 | 73.17,20.59 C22.1
N$25  (via drill 0.61)
  Top 0.254: 81.4,45.73 IC6.1 | IC6.4 81.4,42.76 v81.4,45.28 81.4,45.73 | 81.4,45.73 75.23,45.73 73.86,47.1 70.66,47.1 L2.2
  Bottom 0.254: v81.4,45.28 80.72,45.96 79.12,45.96 C17.1
N$27  (via drill 0.61)
  Top 0.254: 70.2,29.27 68.37,31.1 L3.1 68.37,31.33 v68.37,33.16 | 70.2,29.27 72.94,26.53 78.43,26.53 79.57,25.39 79.57,23.56 80.72,22.42 83,22.42 83.46,22.87 83.46,25.39 78.66,30.19 78.66,30.87 IC7.21 | 70.2,29.27 v70.43,29.5
  Bottom 0.254: 70.66,29.27 71.57,30.19 82.09,30.19 83.23,29.04 R10.2 | 70.66,29.27 69.97,28.59 69.97,27.9 C18.1 | C19.1 68.37,30.87 v68.37,33.16 68.37,34.76 67,36.13 R6.2 | v70.43,29.5 70.66,29.27
N$28  (via drill 0.61)
  Top 0.254: v65.86,21.96 65.86,23.1 65.17,23.79 L4.2 64.94,24.02 64.94,29.04 | 64.94,29.04 64.94,31.1 L3.2 | 64.94,29.04 v64.71,29.04
  Bottom 0.254: C20.1 62.2,28.13 63.8,28.13 v64.71,29.04 66.31,30.64 C19.2 | v65.86,21.96 65.86,23.56 C21.1
N$29
  Top 0.254: C9.1 51.68,46.19 51.68,42.99 53.97,40.7 54.66,40.7 IC4.6
N$30  (via drill 0.61)
  Top 0.254: v24.48,22.19 26.54,20.13 28.59,20.13 29.51,19.21 29.51,18.53 30.65,17.39 IC1.11 | v35,32.47 v30.42,27.9 | v55.11,46.65 62.2,46.65 63.57,45.28 70.2,45.28 70.43,45.5 74.77,45.5 75.91,44.36 77.97,44.36 79.57,42.76 v79.57,40.25 | v78.71,35.95 78.66,37.27 78.66,38.19 IC7.8
  Bottom 0.254: v24.48,22.19 30.2,27.9 v30.42,27.9 | v35,32.47 38.43,32.47 52.6,46.65 v55.11,46.65 | v79.57,40.25 79.57,36.82 v78.71,35.95
N$31
  Top 0.406: IC6.3 78.1,42.68 IC7.9
N$32  (via drill 0.61)
  Top 0.254: v33.85,20.13 33.85,18.76 33.17,18.07 31.57,18.07 30.65,18.99 T2.1 | v52.14,24.47 52.14,21.73 53.74,20.13 53.74,17.39 T1.1
  Bottom 0.254: R14.1 33.62,24.02 33.85,23.79 v33.85,20.13 33.85,17.39 35.45,15.79 36.37,15.79 37.51,16.93 47.11,16.93 52.14,21.96 v52.14,24.47
N$33  (via drill 0.61)
  Top 0.254: 80.49,25.16 81.86,23.79 L5.1 | 80.49,25.16 75.46,30.19 75.46,30.87 IC7.16 | 80.49,25.16 v81.4,26.07
  Bottom 0.254: 81.63,24.02 81.63,21.04 C24.1 | 87.12,24.02 87.12,26.53 R8.2 | 87.12,24.02 87.12,22.87 R7.2 | 87.12,24.02 81.63,24.02 | 81.63,24.02 C23.2 81.4,24.24 v81.4,26.07
N$34
  Top 0.254: IC1.30 30.65,6.41 30.65,5.73 31.34,5.04 40.48,5.04 43.91,8.47 43.91,17.16 45.74,18.99 JP8.1 51.23,28.36 51.23,41.16 49.4,42.99 48.71,42.99 IC4.9
N$35
  Top 0.254: T1.3 53.05,14.87 58.31,14.87 59,14.19 D5.A 59.23,13.96 62.2,10.99 66.08,10.99 K2.A1
N$36  (via drill 0.61)
  Top 0.254: v75.91,36.13 76.14,36.36 76.14,38.19 IC7.12
  Bottom 0.254: v75.91,36.13 75.91,37.5 76.14,37.73 R13.2 76.37,37.96 76.37,41.16 R15.2
N$37  (via drill 0.61)
  Top 0.254: v74.77,27.44 74.77,30.87 IC7.15
  Bottom 0.254: C25.1 72.71,25.16 74.77,27.22 v74.77,27.44 76.14,28.82 R11.2 76.37,29.04 80.49,29.04 R10.1
N$38
  Top 0.254: IC7.14 74.77,38.42 67.69,38.42 64.94,41.16 SL8.3
N$39  (via drill 0.61)
  Top 0.254: v29.51,8.47 29.28,8.7 25.17,8.7 IC1.23 | v30.88,22.87 32.71,22.87 v38.65,28.82
  Bottom 0.254: v29.51,8.47 31.79,8.47 32.94,9.61 32.94,16.24 30.88,18.3 v30.88,22.87 | v38.65,28.82 57.4,47.56 85.29,47.56 89.4,43.45 89.4,42.76 IC8.2 89.63,42.53 90.77,41.39 90.77,37.5 R5.2
N$40  (via drill 0.61)
  Top 0.254: v78.43,33.11 78.2,32.25 78.2,31.1 IC7.20 | v71.8,29.04 71.8,29.5 v73.1,32.07
  Bottom 0.254: v78.43,33.11 76.6,34.3 R12.2 76.37,34.07 74.95,33.67 74.95,32.07 v73.1,32.07 | v71.8,29.04 73.4,29.04 R11.1
N$41
  Bottom 0.254: SL6.2 76.37,4.81 78.89,7.33 82.77,7.33 86.2,10.76 K2.11
N$42
  Top 0.254: 8.02,6.64 8.25,6.87 SL9.3 | 3.68,6.64 T3.1
  Top 1.016: 8.02,6.64 3.68,6.64
  Bottom 0.254: R50.1 46.2,10.76 44.83,10.76 37.28,3.21 12.14,3.21 8.48,6.87 SL9.3
N$43  (via drill 0.61)
  Top 0.254: v11.68,9.39 10.99,8.7 4.59,8.7 T3.3 4.36,8.47 3.45,7.56 2.08,7.56 1.85,7.78 1.85,12.81 3.68,14.64 9.62,14.64 14.88,19.9 20.82,19.9 24.02,23.1 28.14,23.1 29.74,21.5 31.57,21.5 T2.3
  Bottom 0.254: v11.68,9.39 12.36,9.39 13.05,10.07 R17.2
N$44  (via drill 0.61)
  Top 0.254: IC1.31 31.57,6.41 31.57,5.73 31.79,5.5 40.25,5.5 43.45,8.7 43.45,18.07 v44.83,19.44 43.23,21.04 v43.23,35.9 | v45.05,37.73 47.8,40.47 48.48,40.47 IC4.11
  Bottom 0.254: v44.83,19.44 48.26,22.87 JP8.2 | v43.23,35.9 v45.05,37.73
N$45  (via drill 0.61)
  Top 0.254: IC1.13 29.05,14.41 28.59,13.96 26.31,13.96 v24.99,15.28 | v20.82,14.64 19.22,16.24 19.22,16.7 18.31,17.61 17.39,17.61 v16.02,18.99 | v28.82,36.36 30.2,37.73 32.71,37.73 40.71,29.73 v40.71,28.59 | IC1.13
  Bottom 0.254: v20.82,14.64 v24.99,15.28 | v16.02,18.99 16.02,23.1 17.62,24.7 17.62,28.59 17.39,28.82 17.39,31.33 18.99,32.93 21.28,32.93 24.71,36.36 v28.82,36.36 | v40.71,28.59 40.25,28.13 40.25,26.07 38.88,24.7 36.83,24.7 36.37,24.24 R14.2
N$46  (via drill 0.61)
  Top 0.254: K2.A2 66.08,18.53 60.6,24.02 59.23,24.02 D5.C 59,24.24 54.2,24.24 53.05,25.39 51,25.39 49.4,23.79 49.4,17.39 44.37,12.36 44.37,8.24 40.03,3.9 21.51,3.9 16.02,9.39 v16.02,11.9 13.74,14.19 5.96,14.19 3.91,12.13 IC2.1 3.68,11.9 | 2.76,8.7 T3.2
  Top 1.016: 2.76,8.7 2.76,10.99 3.68,11.9
  Bottom 0.254: 2.54,16.7 C1.1 2.54,16.93 2.76,17.16 | 3.68,12.13 IC2.1 | v16.02,11.9 16.02,10.3 R17.1 | 2.76,32.25 D1.C
  Bottom 1.016: 2.54,16.7 2.54,13.27 3.68,12.13 | 2.76,17.16 2.76,32.25
N$47  (via drill 0.61)
  Top 0.254: v35.91,8.01 33.85,8.01 IC1.1
  Bottom 0.254: v35.91,8.01 36.37,8.01 40.48,12.13 44.6,12.13 45.05,12.59 49.63,12.59 53.97,8.24 53.97,7.78 SL11.3
N$48
  Top 0.254: C6.1 58.31,33.85 55.11,33.85 54.88,34.07 IC4.1
N$50
  Top 0.254: IC7.13 75.46,38.42 75.46,39.79 71.57,43.68 64.94,43.68 SL8.2
N$51
  Bottom 0.254: SL4.2 89.63,31.79 87.34,29.5 R9.2 87.12,29.27 89.63,26.76 R8.1
N$52
  Top 0.254: C6.2 58.31,36.59 54.88,36.59 IC4.3
N$76  (via drill 0.61)
  Top 0.254: 17.16,3.44 17.16,7.56 14.65,10.07 v14.65,11.67 | 17.16,3.44 IC9.3 | 17.16,3.44 40.25,3.44 43,6.18 63.57,6.18 67.69,10.3 67.69,18.99 67.23,19.44 67.23,31.56 62.89,35.9 62.89,41.62 63.8,42.53 65.86,42.53 66.54,41.85 70.43,41.85 L2.1
  Bottom 0.254: 14.88,11.67 14.88,16.47 16.94,18.53 16.94,21.73 19.22,24.02 19.91,24.02 21.51,25.62 JP2.1 | 14.88,11.67 14.88,9.16 15.11,8.93 16.48,8.93 18.54,6.87 20.59,6.87 C16.1 | 14.88,11.67 v14.65,11.67
RESET
  Top 0.254: IC1.29 29.74,6.41 29.74,5.73 28.37,4.36 21.74,4.36 19.91,6.18 19.91,14.64 18.31,16.24 JP6.5
SCL
  Top 0.254: IC1.28 29.05,6.64 29.05,7.1 29.51,7.56 32.71,7.56 34.08,6.18 40.25,6.18 43,8.93 43,20.59 39.57,24.02 39.57,29.27 34.77,34.07 31.57,34.07 JP4.2 31.34,34.07 28.37,34.07 26.54,32.25 26.54,31.56 IC5.7
  Bottom 0.254: R4.2 31.57,30.87 31.57,34.07 JP4.2
SDA  (via drill 0.61)
  Top 0.254: v22.19,5.27 27.68,5.27 28.14,5.73 28.14,6.41 IC1.27 | 18.31,32.93 18.31,34.76 20.14,36.59 JP3.2 | 18.31,32.93 v18.31,29.27 | 18.31,32.93 24.48,32.93 25.17,32.25 25.17,31.56 IC5.6
  Bottom 0.254: v22.19,5.27 19.45,5.27 16.25,8.47 11.22,8.47 10.76,8.93 10.76,13.04 15.11,17.39 15.11,31.56 20.14,36.59 JP3.2 | v18.31,29.27 19.22,30.19 19.22,30.87 R3.2
VDD  (via drill 0.61)
  Top 0.254: 24.02,30.64 24.02,31.33 IC5.5 24.02,30.64 | 24.02,30.64 24.71,29.96 27,29.96 | 27,29.96 27.68,30.64 27.68,31.33 IC5.8 | 24.02,30.64 21.51,30.64 16.71,25.84 JP2.3 | 27,29.96 27.45,29.5 | 27.45,29.5 31.34,25.62 L1.2 | IC4.16 48.71,34.07 49.86,32.93 49.86,30.42 C8.1 49.86,30.19 v44.14,30.19 | v27.22,29.5 27.45,29.5 | 80.26,37.05 80.03,37.27 80.03,38.19 IC7.6 | 80.26,37.05 80.94,37.05 81.4,37.5 81.4,38.19 | 81.4,38.19 81.86,38.19 IC7.3 | 81.4,38.19 IC7.4 | 76.83,34.48 76.83,38.19 IC7.11 | 76.83,34.48 76.83,31.1 IC7.18 | 79.75,34.48 80.03,32.93 80.03,31.1 IC7.23 | 76.83,34.48 79.75,34.48 | 80.26,37.05 80.26,34.99 v79.8,34.53 79.75,34.48
  Bottom 0.254: 32.48,27.22 38.88,27.22 C13.1 39.11,27.22 39.57,27.67 39.57,28.82 40.94,30.19 v44.14,30.19 | 32.48,27.22 29.05,30.64 R4.1 28.82,30.87 27.22,30.87 | 27.22,30.87 22.19,30.87 R3.1 | 33.4,13.73 33.4,16.47 31.79,18.07 31.79,26.53 32.48,27.22 | 33.4,13.73 33.4,9.39 31.57,7.56 29.05,7.56 28.59,8.01 22.42,8.01 18.77,11.67 JP1.2 | 27.22,30.87 v27.22,29.5 | R5.1 88.03,37.27 85.06,37.27 82.32,34.53 81.63,34.53 C12.1 81.4,34.53 v79.8,34.53 79.8,32.47 77.97,30.64 70.2,30.64 68.6,29.04 66.08,29.04 59.91,22.87 55.27,22.87 55.27,20.97 53.51,20.97 53.51,15.56 | SL13.2 60.14,5.27 57.4,8.01 57.4,10.76 C14.1 57.17,10.99 53.51,14.64 53.51,15.56 | 33.4,13.73 39.57,13.73 41.4,15.56 53.51,15.56

### Text on the board
Top: 1 | 1 | 1
Bottom: 70MHz DDS | Generator | V03.0 | DK1RI